# EAGLE design dual-Joystick-Breakout-v1 (EAGLE 6.5.0)
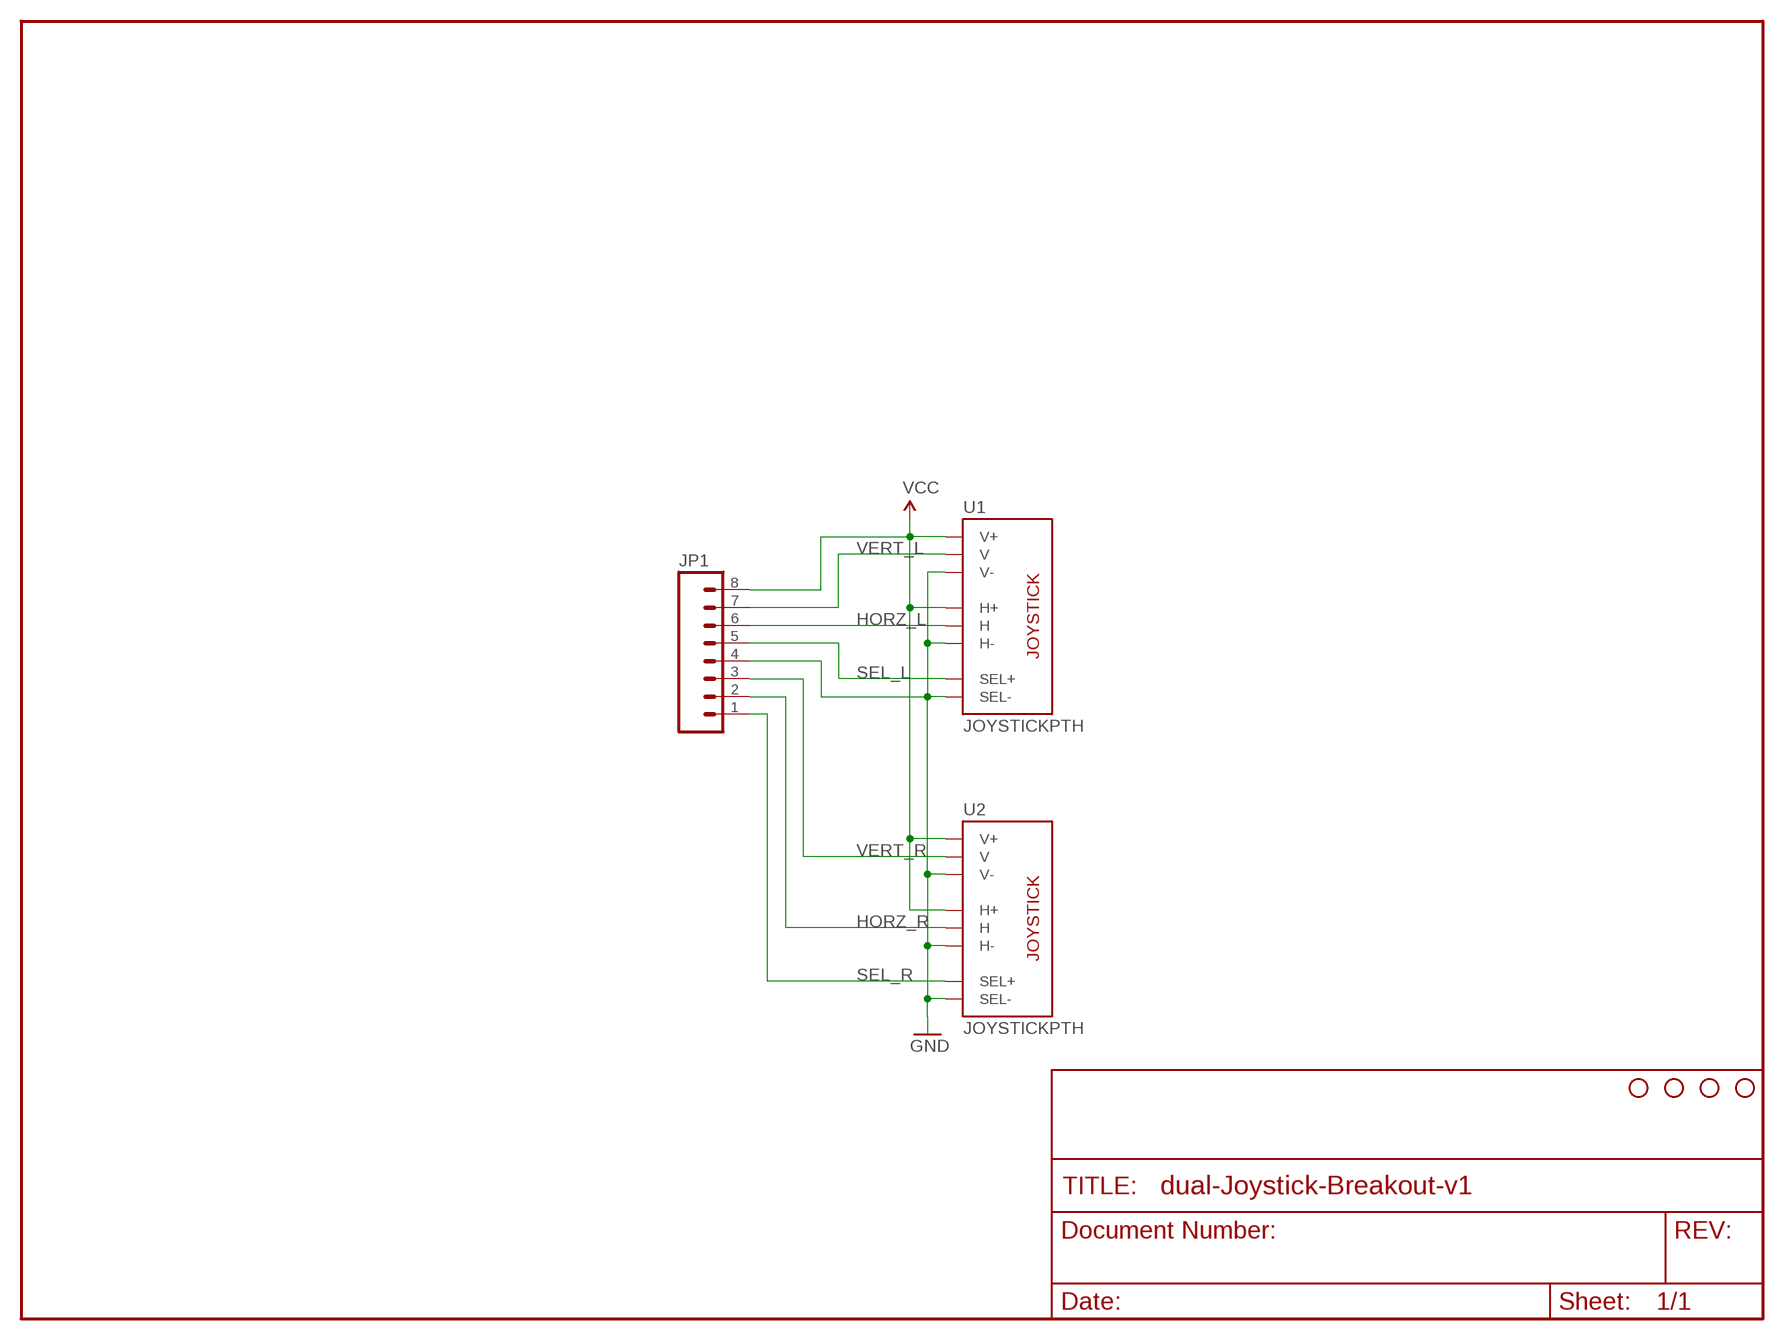
[diagram p0: schematic, sheet 1]

## Parts
JP1  M081X08  [1X08]
U1  JOYSTICKPTH  [JOYSTICK]
U2  JOYSTICKPTH  [JOYSTICK]
U$3  STAND-OFF  [STAND-OFF]
U$4  STAND-OFF  [STAND-OFF]
U$5  STAND-OFF  [STAND-OFF]
U$6  STAND-OFF  [STAND-OFF]

## Nets
GND: JP1.4 U1.B2A(SEL-) U1.H3(H-) U1.V3(V-) U2.B2A(SEL-) U2.H3(H-) U2.V3(V-)
HORZ_L: JP1.6 U1.H2(H)
HORZ_R: JP1.2 U2.H2(H)
SEL_L: JP1.5 U1.B1A(SEL+)
SEL_R: JP1.1 U2.B1A(SEL+)
VCC: JP1.8 U1.H1(H+) U1.V1(V+) U2.H1(H+) U2.V1(V+)
VERT_L: JP1.7 U1.V2(V)
VERT_R: JP1.3 U2.V2(V)

## Library data of the parts
JP1 = SparkFun-Connectors:M08: Header 8 Standard 8-pin 0.1" header. Use with straight break away headers (SKU : PRT-00116), right angle break away headers (PRT-00553), swiss pins (PRT-00743), machine pins (PRT-00117), and female headers (PRT-00115).
U1 U2 = SparkFun:JOYSTICK: Thumb Joystick Joystick commonly found in PS2 controllers. Two pots and a select switch. Footprint proven. Spark Fun Electronics SKU : COM-09032
U$3-U$6 = SparkFun:STAND-OFF: Stand Off This is the mechanical footprint for a #4 phillips button head screw. Use the keepout ring to avoid running the screw head into surrounding components. SKU : PRT-00447

## Board
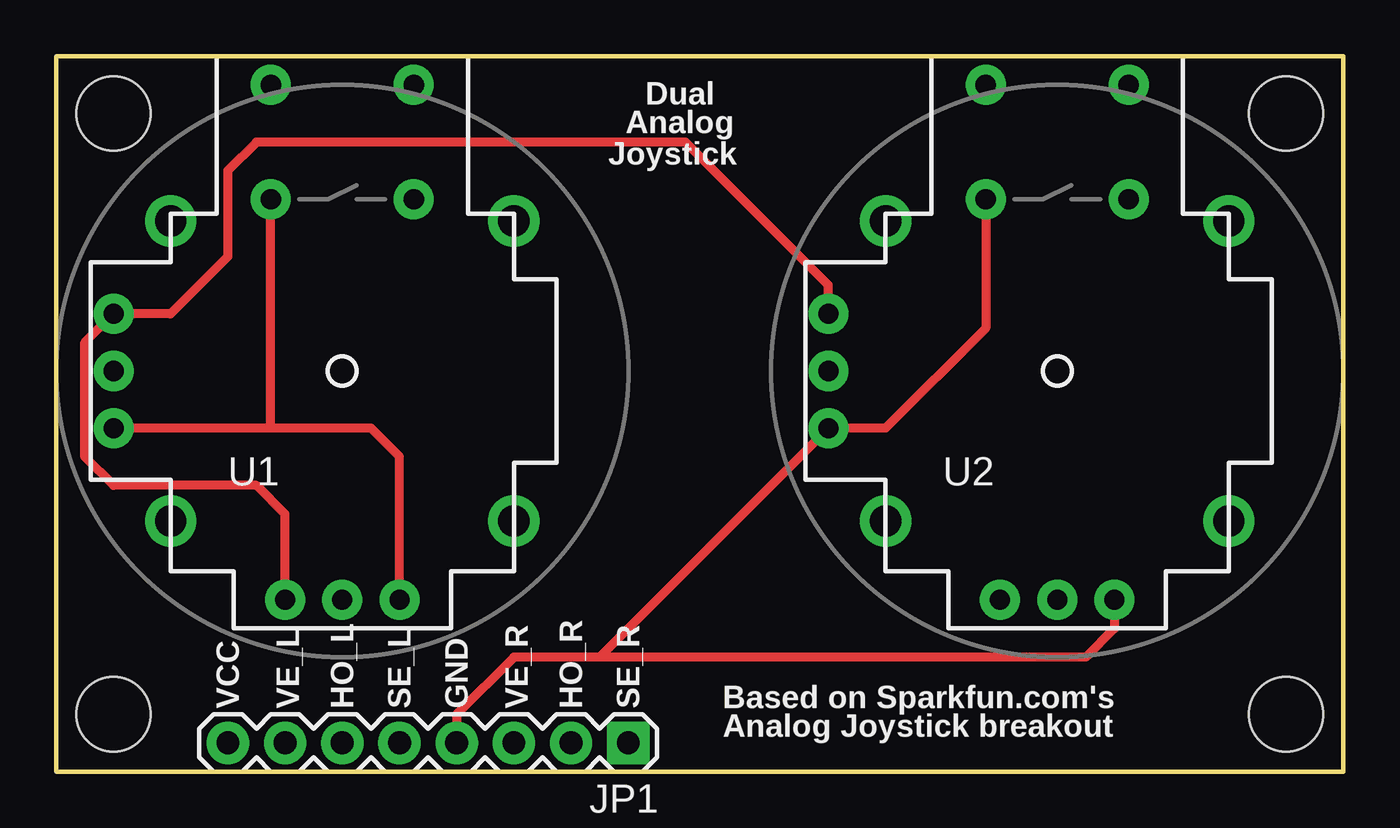
[diagram p1: board, top side]
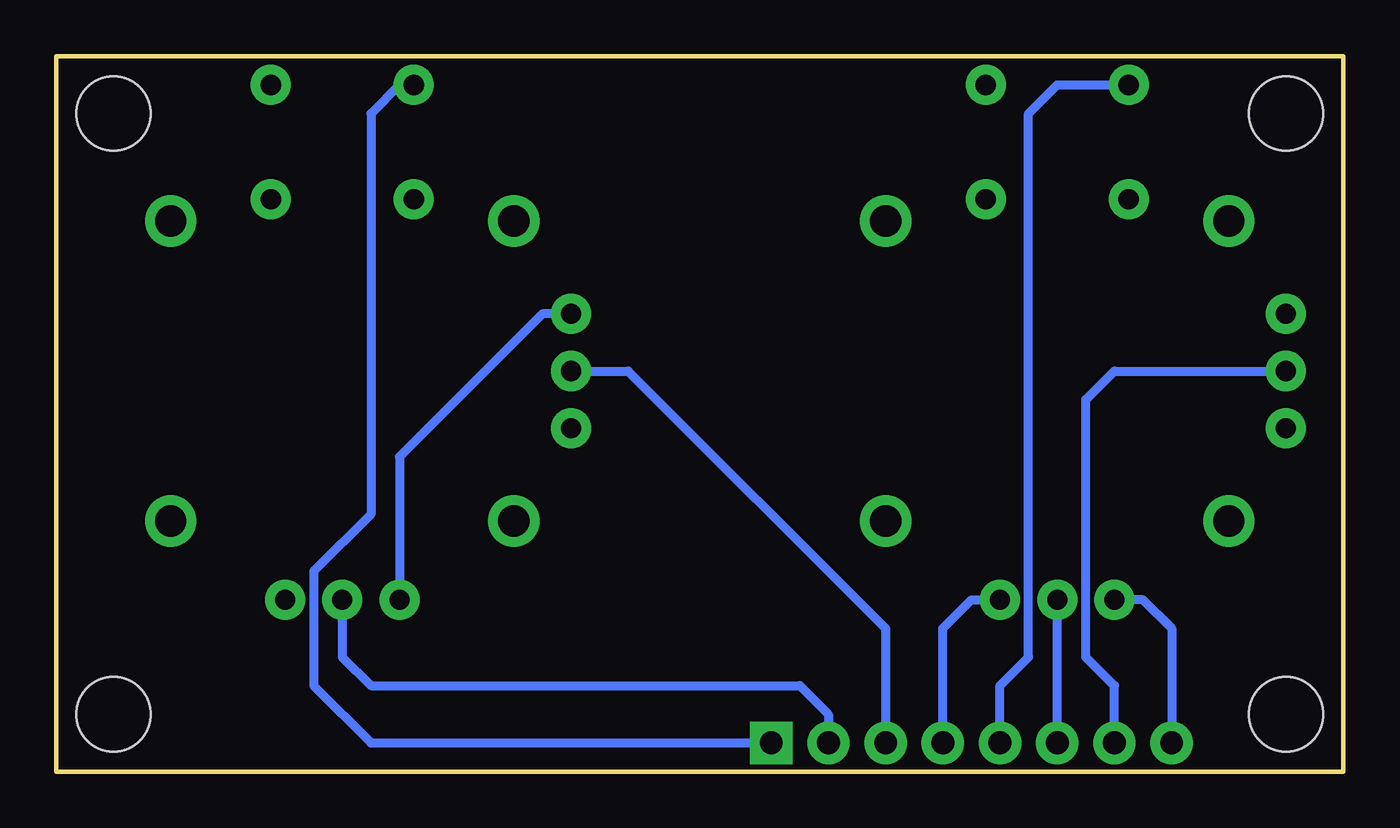
[diagram p2: board, bottom side, seen from below]

Size 57.15 x 31.75 mm. Coordinates in mm from the lower left corner, seen from the top.
Outline: 0,0 57.15,0 57.15,31.75 0,31.75 0,0
Copper layers (1*16): Top 0.035mm / dielectric 1.5mm / Bottom 0.035mm
Design rules "SparkFun": minimum track width 8mil, minimum drill 20mil, track to track 8mil, track to pad 8mil, pad to pad 8mil, via to via 8mil, smd to smd 8mil, copper to edge 10mil, drill to drill 8mil, minimum pad ring 12mil, minimum via ring 10mil, stop-mask expansion 4mil, vias tented up to drill 25mil, thermal gap 10mil

### Footprints (pad centres in the part's own frame; a part is rotated, then mirrored left to right if it is on the bottom)
1X08 = drill 1.016 pad 1.88 square: 1 0,0 | drill 1.016 pad 1.88: 2 2.54,0; 3 5.08,0; 4 7.62,0; 5 10.16,0; 6 12.7,0; 7 15.24,0; 8 17.78,0
JOYSTICK = drill 0.9 pad 1.778: B1A -3.175,12.7; B1B 3.175,12.7; B2A -3.175,7.62; B2B 3.175,7.62 | drill 0.889 pad 1.778: H1 -2.54,-10.16; H2 0,-10.16; H3 2.54,-10.16; V1 -10.16,2.54; V2 -10.16,0; V3 -10.16,-2.54 | drill 1.397 pad 2.286: MOUNT1 -7.62,6.668; MOUNT2 -7.62,-6.668; MOUNT3 7.62,-6.668; MOUNT4 7.62,6.668
STAND-OFF = hole 3.302: 0,0

### Placement (x,y rotation side)
JP1  25.4,1.27 180 top
U1  12.7,17.78 0 top
U2  44.45,17.78 0 top
U$3  2.54,2.54 0 top
U$4  54.61,2.54 0 top
U$5  2.54,29.21 0 top
U$6  54.61,29.21 0 top

### Tracks (layer width: path | path; a pad name or v marks a point on that pad's centre or on a via)
GND
  Top 0.406: 9.53,15.24 13.97,15.24 15.24,13.97 U1.H3 | 9.53,15.24 U1.V3 | 9.53,15.24 U1.B2A | U2.H3 46.99,6.35 45.72,5.08 24.13,5.08 | 24.13,5.08 20.32,5.08 17.78,2.54 JP1.4 | U2.B2A 41.27,19.68 36.83,15.24 U2.V3 24.13,5.08
  Bottom 0.406: U1.H3 16.51,7.62 17.78,6.35 JP1.4
HORZ_L
  Bottom 0.406: JP1.6 U1.H2
HORZ_R
  Bottom 0.406: U2.H2 44.45,5.08 43.18,3.81 24.13,3.81 22.86,2.54 JP1.2
SEL_L
  Bottom 0.406: U1.B1A 12.7,30.48 13.97,29.21 13.97,5.08 15.24,3.81 JP1.5
SEL_R
  Bottom 0.406: U2.B1A 41.91,30.48 43.18,29.21 43.18,11.43 45.72,8.89 45.72,3.81 43.18,1.27 JP1.1
VCC
  Top 0.406: U1.H1 10.16,11.43 8.89,12.7 2.54,12.7 1.27,13.97 1.27,19.05 U1.V1 5.08,20.32 7.62,22.86 7.62,26.67 8.89,27.94 27.94,27.94 34.29,21.59 U2.V1
  Bottom 0.406: U1.H1 8.89,7.62 7.62,6.35 JP1.8 | U2.V1 35.56,20.32 41.91,13.97 U2.H1
VERT_L
  Bottom 0.406: U1.V2 10.16,17.78 11.43,16.51 11.43,5.08 10.16,3.81 JP1.7
VERT_R
  Bottom 0.406: U2.V2 31.75,17.78 20.32,6.35 JP1.3

### Text on the board
tPlace: Dual | Analog | Joystick | VCC | VE_L | HO_L | SE_L | GND | VE_R | HO_R | SE_R | Based on Sparkfun.com's | Analog Joystick breakout